# EAGLE design nixie2xd (EAGLE 4.16)
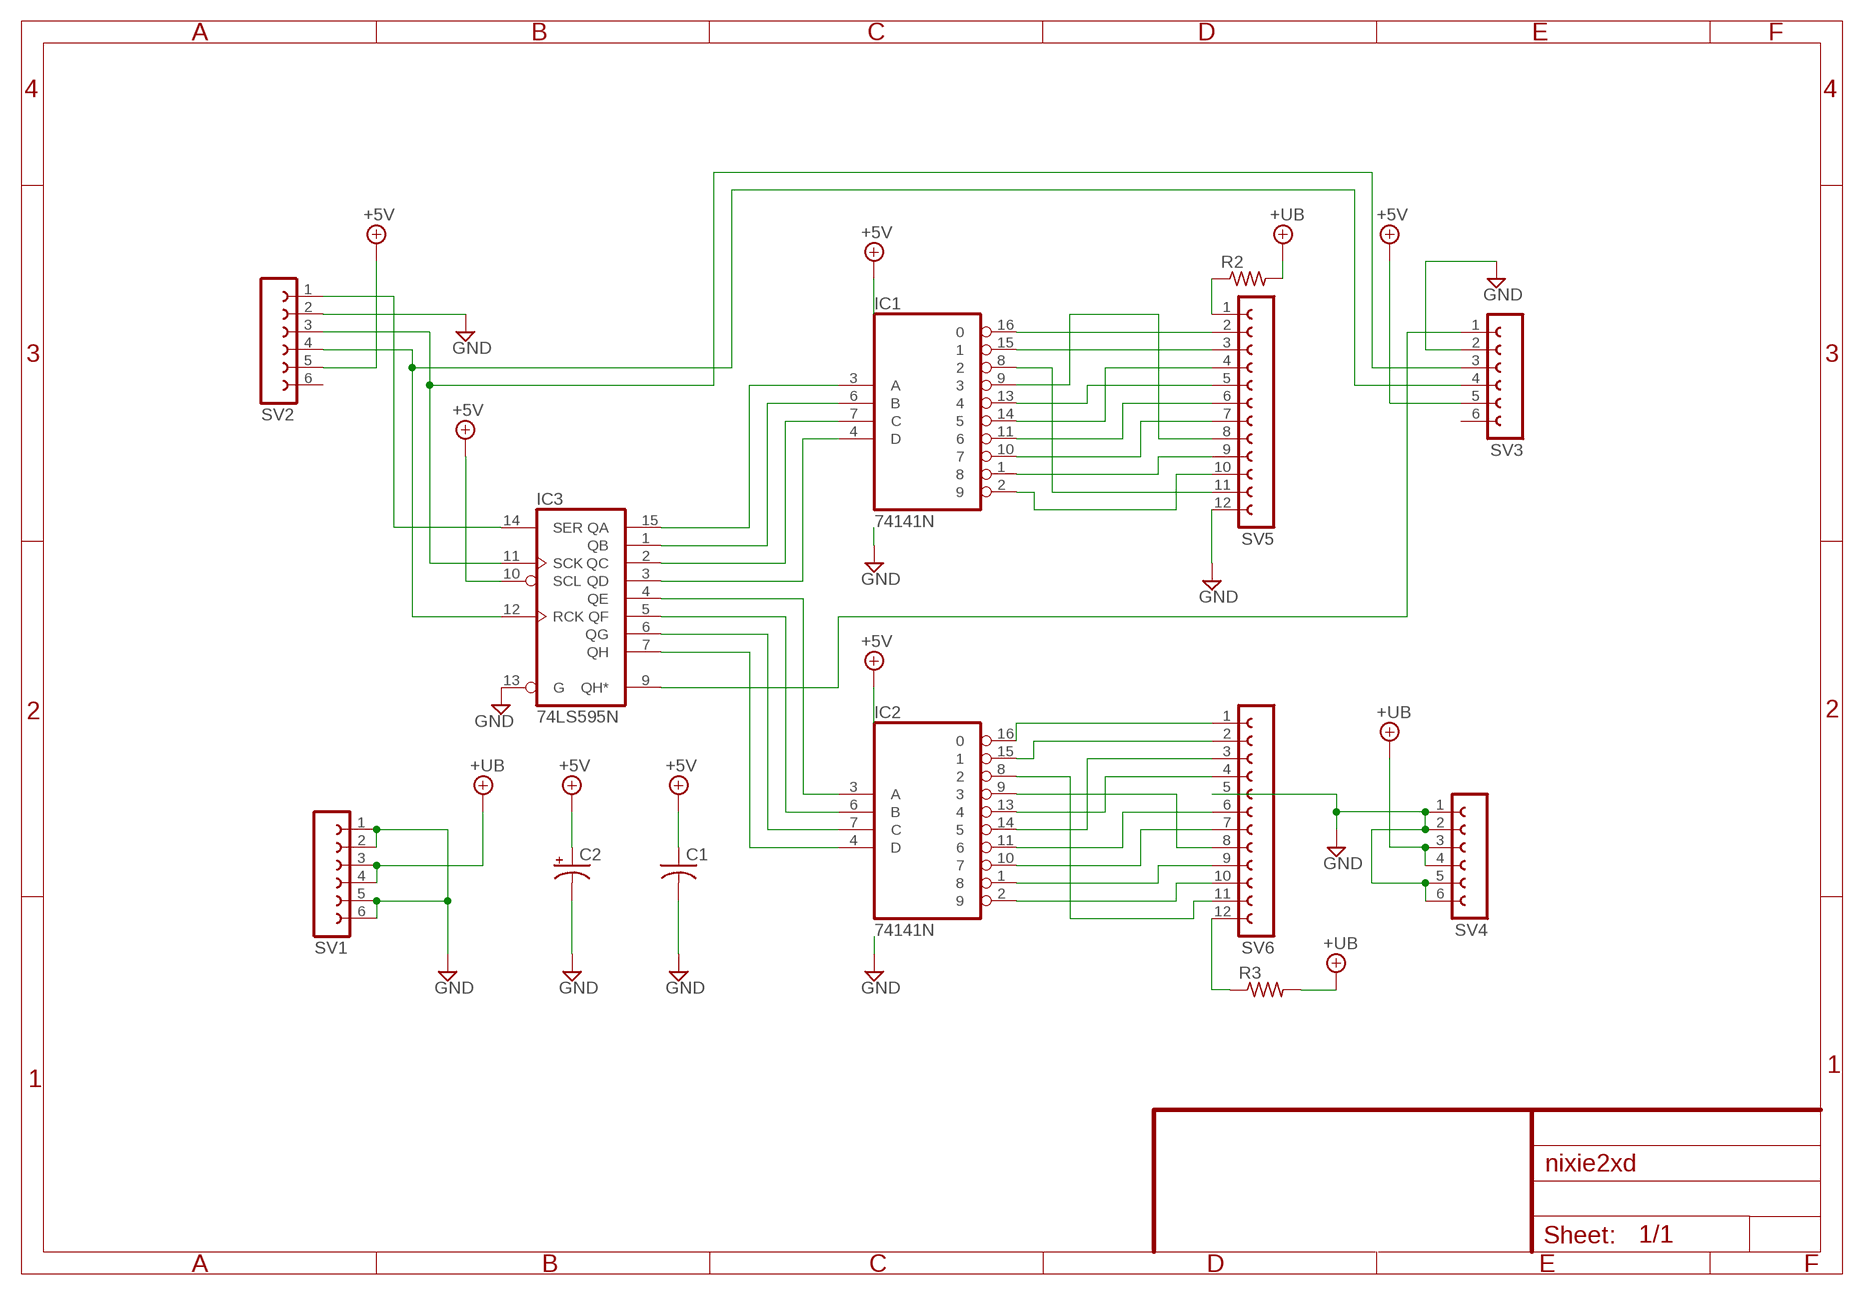
[diagram p0: schematic, sheet 1]

## Parts
C1  C-US050-025X075  [C050-025X075]
C2  CPOL-USE5-5  [E5-5]
IC1  74141N  [DIL16]
IC2  74141N  [DIL16]
IC3  74LS595N  [DIL16]
R2  R-US_0207/2V  [0207/2V]
R3  R-US_0207/2V  [0207/2V]
SV1  FE06-1  [FE06]
SV2  FE06-1  [FE06]
SV3  FE06-1  [FE06]
SV4  FE06-1  [FE06]
SV5  FE12-1  [FE12]
SV6  FE12-1  [FE12]

## Nets
+5V: C1.1 C2.+ IC3.10(SCL) SV2.5 SV3.5
+UB: R2.2 R3.2 SV1.3 SV1.4 SV4.3 SV4.4
GND: C1.2 C2.- IC3.13(G) SV1.1 SV1.2 SV1.5 SV1.6 SV2.2 SV3.2 SV4.1 SV4.2 SV4.5 SV4.6 SV5.12 SV6.5
N$1: IC1.3(A) IC3.15(QA)
N$2: IC1.6(B) IC3.1(QB)
N$3: IC1.7(C) IC3.2(QC)
N$4: IC1.4(D) IC3.3(QD)
N$5: IC2.3(A) IC3.4(QE)
N$6: IC2.6(B) IC3.5(QF)
N$7: IC2.7(C) IC3.6(QG)
N$8: IC2.4(D) IC3.7(QH)
N$9: IC1.16 SV5.2
N$10: IC1.15 SV5.3
N$11: IC1.14 SV5.4
N$12: IC1.13 SV5.5
N$13: IC1.11 SV5.6
N$14: IC1.10 SV5.7
N$15: IC1.9 SV5.8
N$16: IC1.1 SV5.9
N$17: IC1.2 SV5.10
N$18: IC1.8 SV5.11
N$19: R3.1 SV6.12
N$20: IC2.16 SV6.1
N$21: IC2.15 SV6.2
N$22: IC2.14 SV6.3
N$23: IC2.13 SV6.4
N$24: IC2.10 SV6.7
N$25: IC2.11 SV6.6
N$26: IC2.9 SV6.8
N$27: IC2.1 SV6.9
N$28: IC2.2 SV6.10
N$29: R2.1 SV5.1
N$30: IC2.8 SV6.11
N$31: IC3.9(QH*) SV3.1
N$33: IC3.11(SCK) SV2.3 SV3.3
N$34: IC3.12(RCK) SV2.4 SV3.4
N$35: IC3.14(SER) SV2.1
Unconnected: SV2.6 SV3.6

## Power pins joined to a net without a drawn wire
+5V: IC1.5(VCC) IC2.5(VCC) IC3.16(VCC)
GND: IC1.12(GND) IC2.12(GND) IC3.8(GND)

## Library data of the parts
C1 = rcl:C-US: CAPACITOR, American symbol
C2 = rcl:CPOL-US: POLARIZED CAPACITOR, American symbol
IC1 IC2 = 74xx-us:74*141: BCD to decimal DECODER/DRIVER
IC3 = 74xx-us:74*595: 8-bit SHIFT REGISTER, output latch
R2 R3 = rcl:R-US_: RESISTOR, American symbol
SV1-SV4 = con-lsta:FE06-1: FEMALE HEADER
SV5 SV6 = con-lsta:FE12-1: FEMALE HEADER

## Net classes
1 power: width 0.762 mm, drill 0.508 mm

## Board
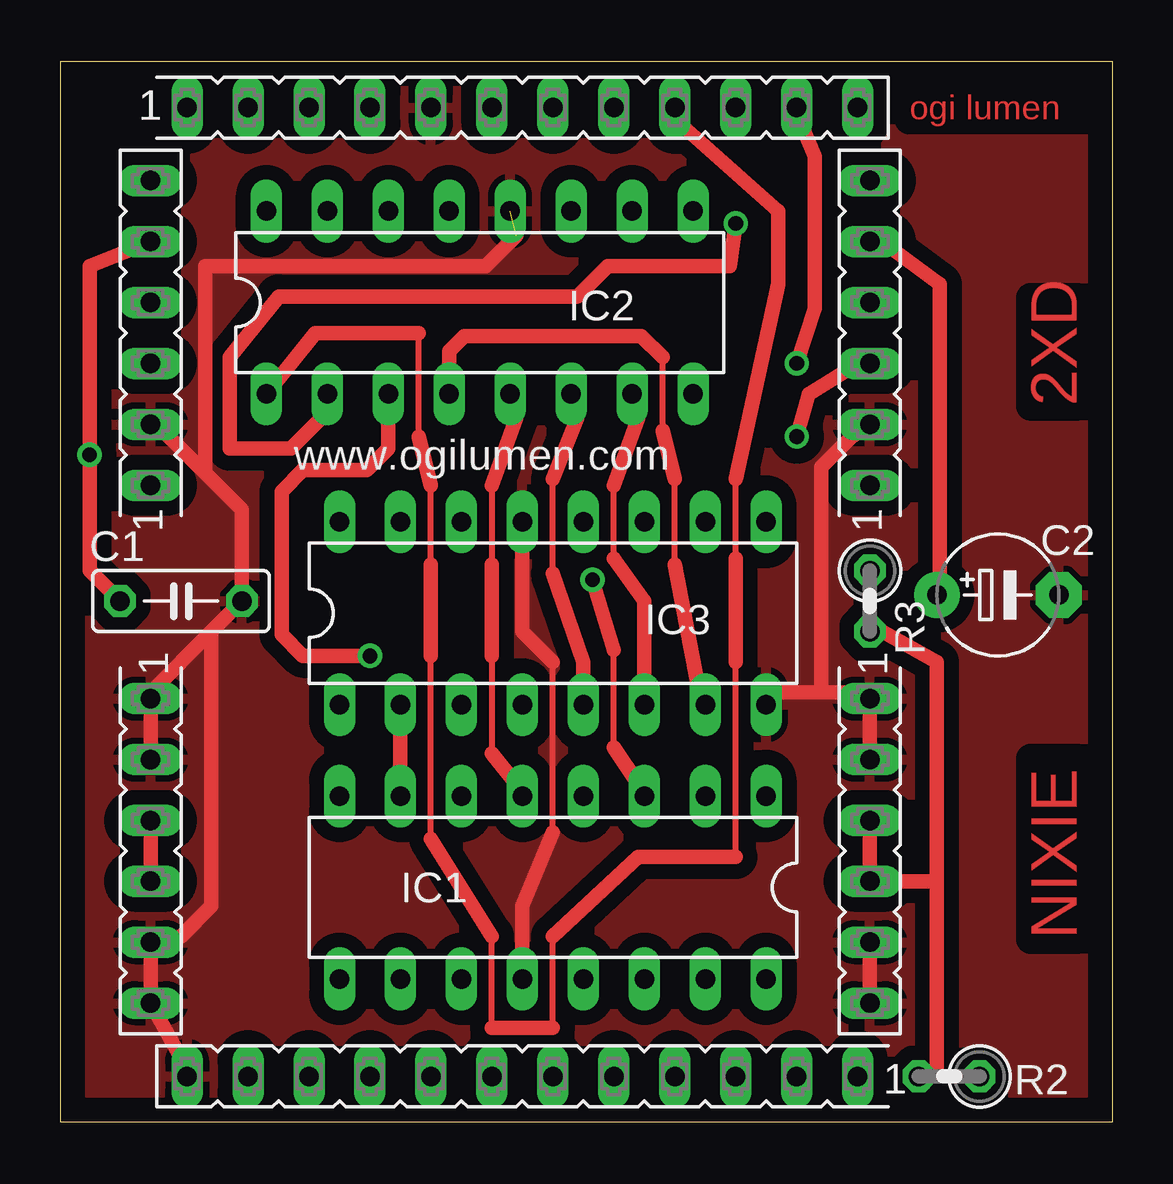
[diagram p1: board, top side]
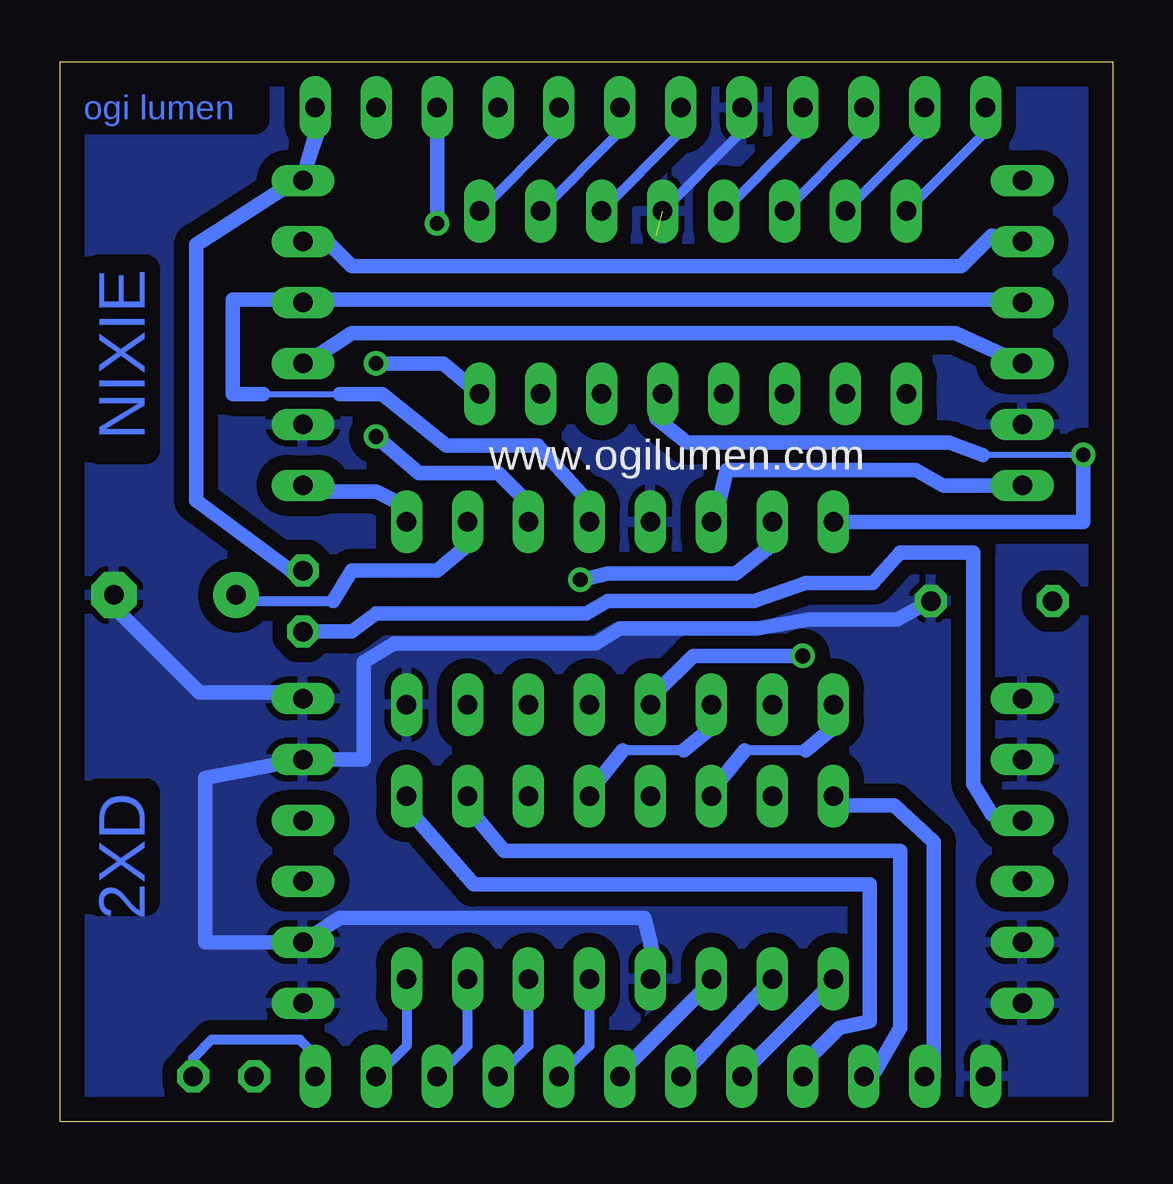
[diagram p2: board, bottom side, seen from below]

Size 43.87 x 44.19 mm. Coordinates in mm from the lower left corner, seen from the top.
Outline: 0,0 43.87,0 43.87,44.19 0,44.19 0,0
Copper layers (1*16): Top 0.035mm / dielectric 1.5mm / Bottom 0.035mm
Design rules "default": minimum track width 10mil, minimum drill 24mil, track to track 8mil, track to pad 8mil, pad to pad 8mil, via to via 8mil, smd to smd 8mil, copper to edge 40mil, drill to drill 8mil, minimum pad ring 10mil, minimum via ring 8mil, stop-mask expansion 4mil, vias tented up to drill 0mil, thermal gap 10mil

### Footprints (pad centres in the part's own frame; a part is rotated, then mirrored left to right if it is on the bottom)
C050-025X075 = drill 0.813 octagon: 1 -2.54,0; 2 2.54,0
E5-5 = drill 0.813 pad 1.905 round: + -2.54,0 | drill 0.813 pad 1.905 octagon: - 2.54,0
DIL16 = drill 0.813 long: 1 -8.89,-3.81; 2 -6.35,-3.81; 3 -3.81,-3.81; 4 -1.27,-3.81; 5 1.27,-3.81; 6 3.81,-3.81; 7 6.35,-3.81; 8 8.89,-3.81; 9 8.89,3.81; 10 6.35,3.81; 11 3.81,3.81; 12 1.27,3.81; 13 -1.27,3.81; 14 -3.81,3.81; 15 -6.35,3.81; 16 -8.89,3.81
0207/2V = drill 0.813 octagon: 1 -1.27,0; 2 1.27,0
FE06 = drill 0.813 long: 1 -6.35,0; 2 -3.81,0; 3 -1.27,0; 4 1.27,0; 5 3.81,0; 6 6.35,0
FE12 = drill 0.813 long: 1 -13.97,0; 2 -11.43,0; 3 -8.89,0; 4 -6.35,0; 5 -3.81,0; 6 -1.27,0; 7 1.27,0; 8 3.81,0; 9 6.35,0; 10 8.89,0; 11 11.43,0; 12 13.97,0

### Placement (x,y rotation side)
C1  5.04,21.71 0 top
C2  39.08,21.97 0 top
IC1  20.54,9.77 180 top
IC2  17.49,34.16 0 top
IC3  20.54,21.2 0 top
R2  37.05,1.9 180 top
R3  33.74,21.71 270 top
SV1  33.74,11.3 270 top
SV2  3.77,32.89 90 top
SV3  33.74,32.89 90 top
SV4  3.77,11.3 270 top
SV5  19.27,1.9 180 top
SV6  19.27,42.29 0 top

### Tracks (layer width: path | path; a pad name or v marks a point on that pad's centre or on a via)
+5V  (via drill 0.6)
  Top 0.254: SV3.5 34.25,36.7 | 36.67,22.22 C2.+ | 18,26.54 18,23.24 | 18,19.43 18,15.36 | 19.01,14.09 IC1.5 | IC2.5 19.01,29.33
  Top 0.61: C1.1 1.23,22.98 v1.23,27.81 1.23,35.68 SV2.5 | 34.25,36.7 36.67,34.92 36.67,22.22 | 18,15.36 19.01,14.09 | 18,23.24 18,19.43 | 19.01,29.33 18,26.54
  Bottom 0.254: 26.63,24.25 IC3.10 | C2.+ 36.79,21.71 | 32.98,36.95 SV3.5 | v1.23,27.81 5.42,27.81 | 19.01,29.33 IC2.5
  Bottom 0.406: 36.79,21.71 32.47,21.71
  Bottom 0.61: 26.63,24.25 28.16,22.98 31.71,22.98 32.47,21.71 | 32.98,36.95 31.71,35.68 6.31,35.68 5.04,36.95 SV2.5 | v1.23,27.81 1.23,25.01 IC3.16 | 5.42,27.81 6.82,28.32 17.74,28.32 19.01,29.33
+UB
  Top 0.254: SV4.3 3.77,12.82 | 36.54,1.9 R2.2 | 33.74,12.82 SV1.3 | R3.2 34.25,20.44
  Top 0.61: SV4.4 SV4.3 | 36.54,10.03 36.54,1.9 | 36.54,10.03 SV1.4 33.74,12.82 | 34.25,20.44 36.54,19.17 36.54,10.03
  Bottom 0.254: SV4.3 5.04,12.82 | R3.2 34.25,20.44
  Bottom 0.61: 5.04,12.82 5.8,14.09 5.8,23.74 8.85,23.74 9.99,22.47 12.79,22.47 14.95,21.71 21.04,21.71 21.93,21.2 30.7,21.2 31.71,20.44 R3.2
GND  (1 unrouted)
  Top 0.254: 29.17,17.9 IC3.8 | SV1.1 32.98,17.9 | 20.54,12.06 20.54,19.17 | 19.27,24.25 IC3.13 | SV4.5 3.77,7.74 | 5.04,2.66 SV5.12 | 3.77,17.9 SV4.1 | 4.03,29.08 SV2.2
  Top 0.61: SV1.2 SV1.1 | 32.98,17.9 31.71,17.9 | 31.71,17.9 29.17,17.9 | 31.71,17.9 31.71,27.3 32.98,28.57 SV3.2 | SV1.5 SV1.6 | 19.27,24.25 19.27,20.44 20.54,19.17 | 5.04,2.66 SV4.6 SV4.5 5.04,7.74 6.31,9.01 6.31,20.44 | SV4.1 SV4.2 | 6.31,20.44 C1.2 7.58,25.52 6.06,27.05 | 6.31,20.44 3.77,17.9 | 6.06,27.05 4.03,29.08 | 19.01,36.95 17.74,35.68 6.06,35.68 6.06,27.05 | 20.54,12.06 19.27,9.01 19.27,6.73 19.52,6.73 19.52,5.96 IC1.12
  Bottom 0.254: 41.87,21.71 C2.- | SV1.1 34.25,17.9 | 19.01,6.47 IC1.12
  Bottom 0.406: SV6.5 15.46,41.27 IC2.12
  Bottom 0.61: 41.87,21.71 38.06,17.9 34.25,17.9 | 19.01,6.47 19.52,8.5 32.22,8.5 SV1.5 37.81,7.49 37.81,14.35 SV1.2 31.2,15.11 31.2,19.17 29.93,19.93 21.55,19.93 20.54,20.57 14.82,20.57 12.66,20.95 8.98,20.95 C1.2
  pour Bottom (isolate 0.61): 0.09,44.06 43.9,44.06 43.9,0.12 44.03,-0.01 -0.04,-0.01 -0.04,43.94 0.22,44.19
  pour Top (isolate 0.61): -0.17,44.19 44.03,44.19 44.03,0.25 43.9,0.12 0.22,0.12 -0.29,-0.39 -0.29,43.81 0.09,44.19
N$1  (via drill 0.61)
  Top 0.254: 23.08,15.62 23.08,19.68 | IC1.3 24.09,14.09
  Top 0.61: 24.09,14.09 23.08,15.62 | 23.08,19.68 v22.19,22.6
  Bottom 0.254: 13.93,24.25 IC3.15
  Bottom 0.61: v22.19,22.6 22.06,22.6 21.04,22.86 15.71,22.86 13.93,24.25
N$2
  Bottom 0.254: IC3.1 11.39,16.63 | 16.47,14.09 IC1.6
  Bottom 0.406: 12.79,15.49 15.33,15.49
  Bottom 0.61: 11.39,16.63 12.79,15.49 | 15.33,15.49 16.47,14.09
N$3
  Top 0.254: IC1.7 14.19,14.09 | 14.19,16.63 IC3.2
  Top 0.61: 14.19,14.09 14.19,16.63
N$4
  Bottom 0.254: IC3.3 16.47,16.63 | 21.55,14.09 IC1.4
  Bottom 0.406: 17.87,15.49 20.41,15.49
  Bottom 0.61: 16.47,16.63 17.87,15.49 | 20.41,15.49 21.55,14.09
N$5  (via drill 0.61)
  Top 0.61: IC2.3 13.68,28.06 12.79,27.17 10.12,27.17 9.23,26.28 9.23,20.32 10.12,19.43 v12.92,19.43
  Bottom 0.254: 19.01,17.9 IC3.4
  Bottom 0.61: 19.01,17.9 17.49,19.43 v12.92,19.43
N$6
  Top 0.254: 20.54,22.86 20.54,26.79 | 21.55,29.33 IC2.6
  Top 0.61: 20.54,26.79 21.55,29.33 | 20.54,22.86 21.81,19.17 IC3.5
N$7
  Top 0.254: 23.08,23.49 23.08,26.54 | 24.09,29.33 IC2.7 | IC3.6 24.35,17.9
  Top 0.61: 23.08,26.54 24.09,29.33 | 23.08,23.49 24.35,21.71 24.35,17.9
N$8
  Top 0.254: 25.62,23.24 25.62,26.79 | 25.11,28.82 25.11,31.87 | IC3.7 26.63,17.9
  Top 0.61: 26.63,17.9 25.62,23.24 | 25.62,26.79 25.11,28.82 | IC2.4 16.22,32.13 16.85,32.76 24.22,32.76 25.11,31.87
N$9
  Bottom 0.406: IC1.16 29.43,3.17 SV5.2
N$10
  Bottom 0.406: IC1.15 26.89,3.17 SV5.3
N$11
  Bottom 0.406: IC1.14 24.35,3.17 SV5.4
N$12
  Bottom 0.406: IC1.13 21.81,3.17 SV5.5
N$13
  Bottom 0.254: SV5.6 20.54,2.03 | 16.73,5.84 IC1.11
  Bottom 0.61: 20.54,2.03 16.73,5.84 16.6,5.71
N$14
  Bottom 0.254: 14.31,5.96 IC1.10
  Bottom 0.61: SV5.7 13.93,6.22 14.19,5.84 14.31,5.96
N$15
  Bottom 0.61: IC1.9 11.52,5.96 15.58,1.9 SV5.8
N$16
  Bottom 0.254: SV5.9 12.66,2.66 | 29.17,12.82 IC1.1
  Bottom 0.61: 12.66,2.66 11.39,3.93 10.12,4.19 10.12,9.9 26.63,9.9 29.17,12.82
N$17
  Bottom 0.254: 9.87,2.15 SV5.10 | 26.63,12.82 IC1.2
  Bottom 0.61: 9.87,2.15 8.85,3.93 8.85,11.3 25.36,11.3 26.63,12.82
N$18
  Bottom 0.254: 7.46,1.9 SV5.11 | 11.39,13.2 IC1.8
  Bottom 0.61: 7.46,1.9 7.46,11.68 9.11,13.2 11.39,13.2
N$19
  Bottom 0.254: R3.1 34.25,22.98 | 32.98,42.03 SV6.12
  Bottom 0.61: 34.25,22.98 38.19,25.9 38.19,36.57 34.63,38.86 33.74,39.37 | 33.74,39.37 32.86,42.03 | 33.74,39.37 32.98,42.03
N$20
  Bottom 0.406: SV6.1 5.3,41.27 IC2.16
N$21
  Bottom 0.406: SV6.2 7.84,41.27 IC2.15
N$22
  Bottom 0.406: SV6.3 10.38,41.27 IC2.14
N$23
  Bottom 0.406: SV6.4 12.92,41.27 IC2.13
N$24
  Bottom 0.406: SV6.7 20.54,41.27 IC2.10
N$25
  Bottom 0.406: SV6.6 18,41.27 IC2.11
N$26
  Bottom 0.406: SV6.8 23.08,41.27 IC2.9
N$27
  Top 0.254: 15.46,11.81 15.46,19.43 | 15.46,23.24 15.46,26.54 | 14.95,28.57 14.95,32.89 | 18,3.93 18,7.74 | 20.54,3.93 20.54,7.74 | 28.16,11.04 28.16,19.17 | 28.16,23.49 28.16,26.79 | 25.36,42.03 SV6.9
  Top 0.61: 14.95,32.89 10.63,32.89 IC2.1 | 15.46,19.43 15.46,23.24 | 15.46,26.54 14.95,28.57 | 18,7.74 15.46,11.81 | 18,3.93 20.54,3.93 | 20.54,7.74 24.09,11.04 28.16,11.04 | 28.16,19.17 28.16,23.49 | 28.16,26.79 29.93,34.92 29.93,37.97 25.36,42.03
N$28  (via drill 0.61)
  Top 0.61: v28.16,37.46 27.9,35.68 22.82,35.68 21.55,34.41 9.11,34.41 7.07,31.87 7.07,28.06 9.61,28.06 10.88,29.33 10.88,30.09 IC2.2
  Bottom 0.254: 28.16,42.03 SV6.10
  Bottom 0.61: v28.16,37.46 28.16,42.03
N$29
  Bottom 0.406: SV5.1 33.24,2.79 33.87,3.42 37.55,3.42 38.32,2.66 R2.1
N$30  (via drill 0.61)
  Top 0.254: 30.7,42.03 SV6.11
  Top 0.61: v30.7,31.62 31.46,33.9 31.46,40.25 30.7,42.03
  Bottom 0.61: v30.7,31.62 27.9,31.62 IC2.8
N$31
  Bottom 0.254: IC3.9 29.17,25.52 | 33.24,26.28 SV3.1
  Bottom 0.61: 29.17,25.52 30.7,26.28 33.24,26.28
N$33  (via drill 0.61)
  Top 0.254: 33.24,31.62 SV3.3
  Top 0.61: v30.7,28.57 31.2,30.35 33.24,31.62
  Bottom 0.254: IC3.11 24.09,25.52 | 33.24,31.87 SV3.3
  Bottom 0.61: 24.09,25.52 25.62,27.05 28.92,27.05 v30.7,28.57 | SV2.3 6.57,32.89 31.71,32.89 33.24,31.87
N$34
  Bottom 0.254: 35.4,30.35 32.22,30.35 | 21.55,25.52 IC3.12 | SV2.4 4.03,34.28 | 36.67,34.28 36.54,34.41 34.25,34.41 SV3.4 36.67,34.28
  Bottom 0.61: 21.55,25.52 23.96,28.19 27.77,28.19 30.44,30.35 32.22,30.35 | 35.4,30.35 36.67,30.35 36.67,34.28 4.03,34.28
N$35
  Bottom 0.254: 16.47,25.52 IC3.14
  Bottom 0.61: 16.47,25.52 16.09,27.17 8.22,27.17 7.07,26.54 SV2.1

### Text on the board
Top: ogi lumen | 2XD | NIXIE
Bottom: ogi lumen | NIXIE | 2XD
tNames: www.ogilumen.com
bNames: www.ogilumen.com
tValues: 47k | 0.1uF | 100uF | 47k